# EAGLE design what-tinys-it (EAGLE 6.1)
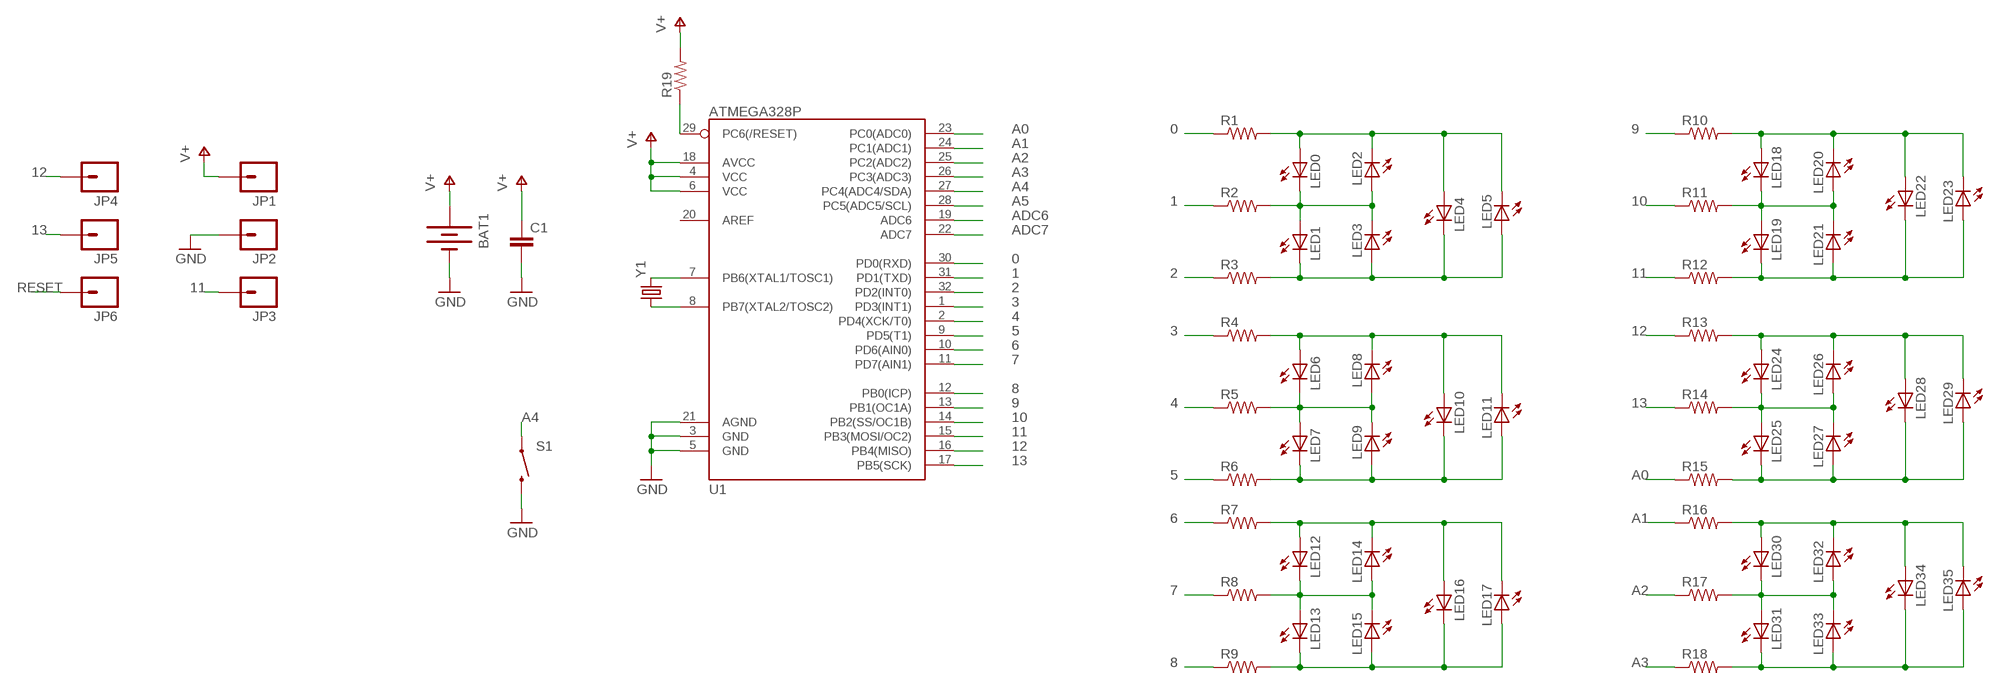
[diagram p0: schematic, sheet 1]

## Parts
BAT1  BATTERY20SMD  [BATTCON_20MM]
C1  C-EUC0805  [C0805]
JP1  M01SMDNS  [1X01NS]
JP2  M01SMDNS  [1X01NS]
JP3  M01SMDNS  [1X01NS]
JP4  M01SMDNS  [1X01NS]
JP5  M01SMDNS  [1X01NS]
JP6  M01SMDNS  [1X01NS]
LED0  LEDCHIPLED_0805  [CHIPLED_0805]
LED1  LEDCHIPLED_0805  [CHIPLED_0805]
LED2  LEDCHIPLED_0805  [CHIPLED_0805]
LED3  LEDCHIPLED_0805  [CHIPLED_0805]
LED4  LEDCHIPLED_0805  [CHIPLED_0805]
LED5  LEDCHIPLED_0805  [CHIPLED_0805]
LED6  LEDCHIPLED_0805  [CHIPLED_0805]
LED7  LEDCHIPLED_0805  [CHIPLED_0805]
LED8  LEDCHIPLED_0805  [CHIPLED_0805]
LED9  LEDCHIPLED_0805  [CHIPLED_0805]
LED10  LEDCHIPLED_0805  [CHIPLED_0805]
LED11  LEDCHIPLED_0805  [CHIPLED_0805]
LED12  LEDCHIPLED_0805  [CHIPLED_0805]
LED13  LEDCHIPLED_0805  [CHIPLED_0805]
LED14  LEDCHIPLED_0805  [CHIPLED_0805]
LED15  LEDCHIPLED_0805  [CHIPLED_0805]
LED16  LEDCHIPLED_0805  [CHIPLED_0805]
LED17  LEDCHIPLED_0805  [CHIPLED_0805]
LED18  LEDCHIPLED_0805  [CHIPLED_0805]
LED19  LEDCHIPLED_0805  [CHIPLED_0805]
LED20  LEDCHIPLED_0805  [CHIPLED_0805]
LED21  LEDCHIPLED_0805  [CHIPLED_0805]
LED22  LEDCHIPLED_0805  [CHIPLED_0805]
LED23  LEDCHIPLED_0805  [CHIPLED_0805]
LED24  LEDCHIPLED_0805  [CHIPLED_0805]
LED25  LEDCHIPLED_0805  [CHIPLED_0805]
LED26  LEDCHIPLED_0805  [CHIPLED_0805]
LED27  LEDCHIPLED_0805  [CHIPLED_0805]
LED28  LEDCHIPLED_0805  [CHIPLED_0805]
LED29  LEDCHIPLED_0805  [CHIPLED_0805]
LED30  LEDCHIPLED_0805  [CHIPLED_0805]
LED31  LEDCHIPLED_0805  [CHIPLED_0805]
LED32  LEDCHIPLED_0805  [CHIPLED_0805]
LED33  LEDCHIPLED_0805  [CHIPLED_0805]
LED34  LEDCHIPLED_0805  [CHIPLED_0805]
LED35  LEDCHIPLED_0805  [CHIPLED_0805]
R1  RESISTOR0805-RES  [0805]
R2  RESISTOR0805-RES  [0805]
R3  RESISTOR0805-RES  [0805]
R4  RESISTOR0805-RES  [0805]
R5  RESISTOR0805-RES  [0805]
R6  RESISTOR0805-RES  [0805]
R7  RESISTOR0805-RES  [0805]
R8  RESISTOR0805-RES  [0805]
R9  RESISTOR0805-RES  [0805]
R10  RESISTOR0805-RES  [0805]
R11  RESISTOR0805-RES  [0805]
R12  RESISTOR0805-RES  [0805]
R13  RESISTOR0805-RES  [0805]
R14  RESISTOR0805-RES  [0805]
R15  RESISTOR0805-RES  [0805]
R16  RESISTOR0805-RES  [0805]
R17  RESISTOR0805-RES  [0805]
R18  RESISTOR0805-RES  [0805]
R19  RESISTOR0805-RES  [0805]
S1  SWITCH-MOMENTARY-2SMD-3  [TACTILE_SWITCH_SMD-3]
U1  ATMEGA328P  ATMEGA328_SMT  [TQFP32-08]
Y1  CRYSTAL32-SMD  [CRYSTAL-32KHZ-SMD]

## Nets
0: R1.1 U1.30(PD0(RXD))
1: R2.1 U1.31(PD1(TXD))
2: R3.1 U1.32(PD2(INT0))
3: R4.1 U1.1(PD3(INT1))
4: R5.1 U1.2(PD4(XCK/T0))
5: R6.1 U1.9(PD5(T1))
6: R7.1 U1.10(PD6(AIN0))
7: R8.1 U1.11(PD7(AIN1))
8: R9.1 U1.12(PB0(ICP))
9: R10.1 U1.13(PB1(OC1A))
10: R11.1 U1.14(PB2(SS/OC1B))
11: JP3.1 R12.1 U1.15(PB3(MOSI/OC2))
12: JP4.1 R13.1 U1.16(PB4(MISO))
13: JP5.1 R14.1 U1.17(PB5(SCK))
A0: R15.1 U1.23(PC0(ADC0))
A1: R16.1 U1.24(PC1(ADC1))
A2: R17.1 U1.25(PC2(ADC2))
A3: R18.1 U1.26(PC3(ADC3))
A4: S1.1 U1.27(PC4(ADC4/SDA))
A5: U1.28(PC5(ADC5/SCL))
ADC6: U1.19(ADC6)
ADC7: U1.22(ADC7)
GND: BAT1.2(-) C1.2 JP2.1 S1.4 U1.3(GND) U1.5(GND) U1.21(AGND)
N$1: LED0.A LED2.C LED4.A LED5.C R1.2
N$2: LED6.A LED8.C LED10.A LED11.C R4.2
N$3: LED0.C LED1.A LED2.A LED3.C R2.2
N$4: LED1.C LED3.A LED4.C LED5.A R3.2
N$5: LED12.A LED14.C LED16.A LED17.C R7.2
N$6: LED6.C LED7.A LED8.A LED9.C R5.2
N$7: LED7.C LED9.A LED10.C LED11.A R6.2
N$8: LED18.A LED20.C LED22.A LED23.C R10.2
N$9: LED12.C LED13.A LED14.A LED15.C R8.2
N$10: LED13.C LED15.A LED16.C LED17.A R9.2
N$11: LED18.C LED19.A LED20.A LED21.C R11.2
N$12: LED24.A LED26.C LED28.A LED29.C R13.2
N$13: LED19.C LED21.A LED22.C LED23.A R12.2
N$14: LED24.C LED25.A LED26.A LED27.C R14.2
N$15: LED30.A LED32.C LED34.A LED35.C R16.2
N$16: U1.7(PB6(XTAL1/TOSC1)) Y1.X2
N$17: LED25.C LED27.A LED28.C LED29.A R15.2
N$18: U1.8(PB7(XTAL2/TOSC2)) Y1.X1
N$19: LED30.C LED31.A LED32.A LED33.C R17.2
N$21: LED31.C LED33.A LED34.C LED35.A R18.2
RESET: JP6.1 R19.1 U1.29(PC6(/RESET))
V+: BAT1.1(+) C1.1 JP1.1 R19.2 U1.4(VCC) U1.6(VCC) U1.18(AVCC)
Unconnected: U1.20(AREF)

## Library data of the parts
BAT1 = SparkFun-Electromechanical:BATTERY: Battery Holders Various common sizes : AA, AAA, 20mm coin cell and 12mm coin cell. 20MM_4LEGS, BATT-10373
C1 = rcl:C-EU: CAPACITOR, European symbol
JP1-JP6 = SparkFun-Connectors:M01: Header 1 Standard 1-pin 0.1" header. Use with straight break away headers (SKU : PRT-00116), right angle break away headers (PRT-00553), swiss pins (PRT-00743), machine pins (PRT-00117), and female headers (PRT-00115).
LED0 LED1-LED35 = adafruit:LED: LED OSRAM: - CHIPLED LG R971, LG N971, LY N971, LG Q971, LY Q971, LO R971, LY R971 LH N974, LH R974 LS Q976, LO Q976, LY Q976 LO Q996 - Hyper CHIPLED LW Q18S LB Q993, LB Q99A, LB R99A - SideLED LS A670, LO A670, LY A670, LG A670, LP A670 LB A673, LV A673, LT A673, LW A673 LH A674 LY A675 LS A676, LA A676, LO A676, LY A676, LW A676 LS A679, LY A679, LG A679 - Hyper Micro SIDELED® LS Y876, LA Y876, LO Y876, LY Y876 LT Y87S - SmartLED LW L88C, LW L88S LB L89C, LB L89S, LG L890 LS L89K, LO L89K, LY L89K LS L896, LA L896, LO L896, LY L896 - TOPLED LS T670, LO T670, LY T670, LG T670, LP T670 LSG T670, LSP T670, LSY T670, LOP T670, LYG T670 LG T671, LOG T671, LSG T671 LB T673, LV T673, LT T673, LW T673 LH T674 LS T676, LA T676, LO T676, LY T676, LB T676, LH T676, LSB T676, LW T676 LB T67C, LV T67C, LT T67C, LS T67K, LO T67K, LY T67K, LW E67C LS E67B, LA E67B, LO E67B, LY E67B, LB E67C, LV E67C, LT E67C LW T67C LS T679, LY T679, LG T679 LS T770, LO T770, LY T770, LG T770, LP T770 LB T773, LV T773, LT T773, LW T773 LH T774 LS E675, LA E675, LY E675, LS T675 LS T776, LA T776, LO T776, LY T776, LB T776 LHGB T686 LT T68C, LB T68C - Hyper Mini TOPLED® LB M676 - Mini TOPLED Santana® LG M470 LS M47K, LO M47K, LY M47K Source: http://www.osram.convergy.de/
R1-R19 = SparkFun-Passives:RESISTOR: Resistor Basic schematic elements and footprints for 0603, 1206, and PTH resistors.
S1 = SparkFun-Electromechanical:SWITCH-MOMENTARY-2: Various NO switches- pushbuttons, reed, etc
U1 = SparkFun-DigitalIC:ATMEGA328_SMT: 32-Pin Atmega328 part Commonly used on Arduino compatible boards Available in QFP and QFN packages TQFP is IC-09069 QFN is non-stock; PROD_ID: IC-09069
Y1 = SparkFun-FreqCtrl:CRYSTAL: Various standard crystals. Proven footprints. Spark Fun Electronics SKU : COM-00534

## Board
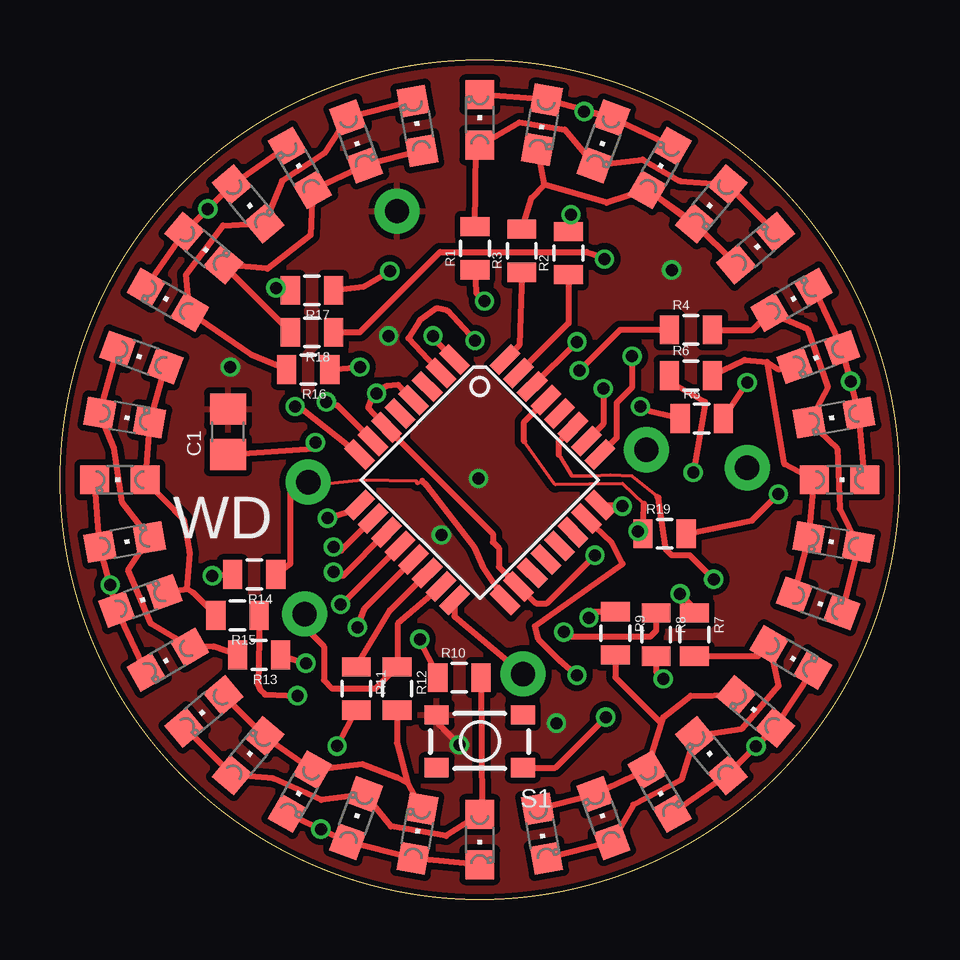
[diagram p1: board, top side]
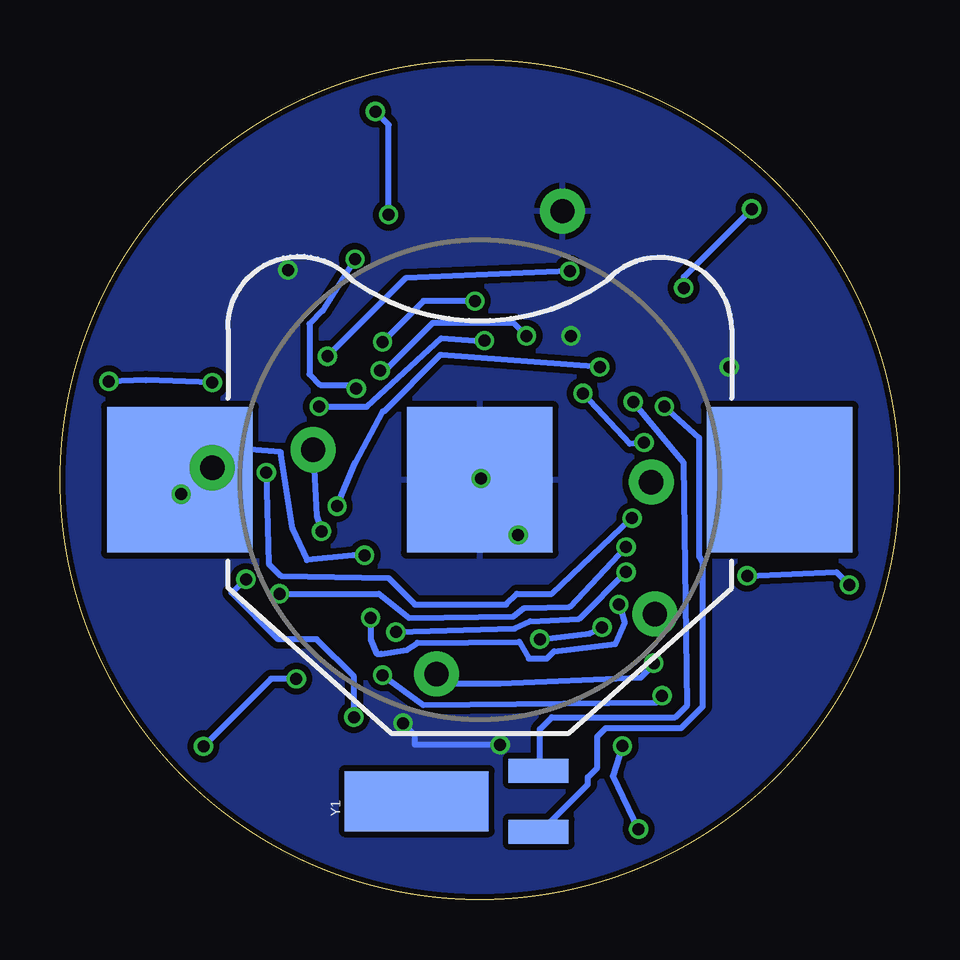
[diagram p2: board, bottom side, seen from below]

Size 35 x 35 mm. Coordinates in mm from the lower left corner, seen from the top.
Outline: circle at 17.5,17.5 radius 17.5
Copper layers (1*16): Top 0.035mm / dielectric 1.5mm / Bottom 0.035mm
Design rules: minimum track width 6mil, minimum drill 12mil, track to track 6mil, track to pad 6mil, pad to pad 6mil, via to via 6mil, smd to smd 0mil, copper to edge 10mil, drill to drill 10mil, minimum pad ring 10mil, minimum via ring 6mil, stop-mask expansion 2mil, vias tented up to drill 100mil, thermal gap 10mil

### Footprints (pad centres in the part's own frame; a part is rotated, then mirrored left to right if it is on the bottom)
BATTCON_20MM = smd 6.07 x 6.07: 1 -12.5,0; 2 0,0; 3 12.5,0
C0805 = smd 1.3 x 1.5: 1 -0.95,0; 2 0.95,0
1X01NS = drill 1.016 pad 1.88: 1 0,0
CHIPLED_0805 = smd 1.2 x 1.2: A 0,-1.05; C 0,1.05
0805 = smd 0.8 x 1.2: 1 -0.9,0; 2 0.9,0
TACTILE_SWITCH_SMD-3 = smd 1 x 0.8: 1 -1.8,1.1; 2 1.8,1.1; 3 -1.8,-1.1; 4 1.8,-1.1
TQFP32-08 = smd 1.27 x 0.559: 1 -4.293,2.8; 2 -4.293,2; 3 -4.293,1.2; 4 -4.293,0.4; 5 -4.293,-0.4; 6 -4.293,-1.2; 7 -4.293,-2; 8 -4.293,-2.8; 17 4.293,-2.8; 18 4.293,-2; 19 4.293,-1.2; 20 4.293,-0.4; 21 4.293,0.4; 22 4.293,1.2; 23 4.293,2; 24 4.293,2.8 | smd 0.559 x 1.27: 9 -2.8,-4.293; 10 -2,-4.293; 11 -1.2,-4.293; 12 -0.4,-4.293; 13 0.4,-4.293; 14 1.2,-4.293; 15 2,-4.293; 16 2.8,-4.293; 25 2.8,4.293; 26 2,4.293; 27 1.2,4.293; 28 0.4,4.293; 29 -0.4,4.293; 30 -1.2,4.293; 31 -2,4.293; 32 -2.8,4.293
CRYSTAL-32KHZ-SMD = smd 2.5 x 6: SHEILD 0,5.08 | smd 1 x 2.5: X1 -1.27,0; X2 1.27,0

### Placement (x,y rotation side)
BAT1  17.5,17.5 0 bottom
C1  7,19.5 90 top
JP1  28.65,18 0 top
JP2  14.05,28.7 0 top
JP3  10.2,11.9 0 top
JP4  19.3,9.4 0 top
JP5  10.35,17.4 0 top
JP6  24.45,18.75 0 bottom
LED0  17.5,32.5 0 top
LED1  20.1,32.3 170 top
LED2  22.65,31.6 160 top
LED3  25,30.5 330 top
LED4  27.15,29 140 top
LED5  29,27.15 310 top
LED6  30.5,25 300 top
LED7  31.61,22.62 110 top
LED8  32.27,20.09 100 top
LED9  32.5,17.5 270 top
LED10  32.25,14.9 80 top
LED11  31.6,12.35 250 top
LED12  30.48,10.09 240 top
LED13  29,7.85 50 top
LED14  27.15,6 40 top
LED15  25,4.5 210 top
LED16  22.65,3.4 20 top
LED17  20.1,2.75 190 top
LED18  17.5,2.5 180 top
LED19  14.9,2.75 350 top
LED20  12.35,3.4 340 top
LED21  10,4.5 150 top
LED22  7.85,6 320 top
LED23  6,7.85 130 top
LED24  4.5,10 120 top
LED25  3.35,12.45 290 top
LED26  2.7,14.9 280 top
LED27  2.5,17.5 90 top
LED28  2.7,20.1 260 top
LED29  3.4,22.6 70 top
LED30  4.5,25 60 top
LED31  6,27.15 230 top
LED32  7.85,29 220 top
LED33  10,30.5 30 top
LED34  12.35,31.6 200 top
LED35  14.9,32.25 10 top
R1  17.3,27.15 90 top
R2  21.2,26.95 90 top
R3  19.25,27.05 90 top
R4  26.3,23.75 0 top
R5  26.75,20.05 0 top
R6  26.3,21.85 0 top
R7  26.45,11.05 270 top
R8  24.85,11.05 270 top
R9  23.15,11.1 270 top
R10  16.65,9.25 0 top
R11  12.35,8.8 270 top
R12  14.05,8.8 270 top
R13  8.3,10.2 180 top
R14  8.1,13.55 180 top
R15  7.4,11.85 180 top
R16  10.35,22.1 180 top
R17  10.5,25.4 180 top
R18  10.5,23.65 180 top
R19  25.2,15.25 0 top
S1  17.5,6.6 180 top
U1  17.5,17.5 315 top
Y1  15.05,4.1 90 bottom

### Tracks (layer width: path | path; a pad name or v marks a point on that pad's centre or on a via)
0  (via drill 0.5)
  Top 0.254: R1.1 17.35,25.3 v17.7,24.95 | v21.55,23.25 U1.30
  Bottom 0.254: v17.7,24.95 19.85,24.95 v21.55,23.25
1
  Top 0.254: R2.1 21.2,24.03 U1.31
2
  Top 0.254: R3.1 19.15,23.11 U1.32
3  (via drill 0.5)
  Top 0.254: R4.1 23.35,23.75 v21.65,22.05 | v15.55,23.5 15.55,23.41 U1.1
  Bottom 0.254: v21.65,22.05 21.45,22.05 19.45,24.05 16.1,24.05 v15.55,23.5
4  (via drill 0.5)
  Top 0.254: R5.1 24.6,20.35 v24.2,20.55 | v17.3,23.3 16.15,24.55 15.7,24.65 15,24.15 14.53,23.4 U1.2
  Bottom 0.254: v24.2,20.55 22.2,20.55 19.1,23.4 17.7,23.3 v17.3,23.3
5  (via drill 0.5)
  Top 0.254: R6.1 25.4,21.6 26.9,20.75 v26.4,17.8 | v11.15,15.9 12.29,16.25 U1.9
  Bottom 0.254: v26.4,17.8 26.3,14 25.8,13.5 21.3,13.4 20.2,12.3 16.4,12.3 15.95,12.75 14.5,12.75 v11.15,15.9
6  (via drill 0.5)
  Top 0.254: R7.1 26.45,12.15 v25.85,12.75 | v11.4,14.7 11.72,14.55 U1.10
  Bottom 0.254: v25.85,12.75 21.7,12.75 20.45,11.75 16.1,11.8 15.65,12.15 13.75,12.2 v11.4,14.7
7  (via drill 0.5)
  Top 0.254: R8.1 24.85,11.2 24.6,10.95 21.05,10.95 v21,11.15 | v11.4,13.65 11.8,13.5 U1.11
  Bottom 0.254: v21,11.15 16.05,11.3 15.4,11.6 13.35,11.7 v11.4,13.65
8  (via drill 0.5)
  Top 0.254: R9.1 22.3,12 v22.05,11.75 | v11.7,12.3 11.63,12.2 U1.12
  Bottom 0.254: v22.05,11.75 22.05,10.85 21.8,10.25 21.6,10.25 20.55,10.4 20.1,10.7 15.85,10.75 15.45,10.05 14.7,10.05 14.4,10.35 11.85,10.65 11.45,11.55 11.6,12.05 v11.7,12.3
9  (via drill 0.5)
  Top 0.254: R10.1 15.75,9.35 15.15,10.5 | 15.1,10.6 15.15,10.5 | 15.15,10.5 v15,10.85 | v12.4,11.35 12.7,12.13 U1.13
  Bottom 0.254: v15,10.85 12.9,11.1 v12.4,11.35
10
  Top 0.254: R11.1 13.75,12.05 U1.14
11
  Top 0.254: U1.15 14.1,11.52 14.1,9.75 R12.1 13.15,8.8 11.35,8.8 11,9.15 11,10.55 9.9,11.65 JP3.1
12  (via drill 0.5)
  Top 0.254: R13.1 10.35,9.8 v10.25,9.85 | U1.16 16.45,11.8 JP4.1
  Bottom 0.254: v10.25,9.85 10.25,9.8 10.8,9.25 16.65,9 19.05,9 JP4.1
13
  Top 0.155: 15.1,17.45 14.9,17.35 14.85,17.45 12.6,17.5 10.85,17.3
  Top 0.254: U1.17 18.55,12.5 17.65,13.85 17.3,14.65 15.25,17.3 15.1,17.45 | JP5.1 10.85,17.3 10.5,17.2 10.3,17.4 9.95,17.4 9.6,17.05 9.6,14 R14.1
A0  (via drill 0.5)
  Top 0.254: R15.1 8.3,10.85 8.25,8.95 8.35,8.75 8.55,8.55 v9.9,8.5 | v21.55,9.35 20.85,9.95 19.95,10.85 19.8,11.4 23.45,14 23,14.88 U1.23
  Bottom 0.254: v9.9,8.5 10.15,8.2 19.85,8.1 v21.55,9.35
A1  (via drill 0.5 pad 0.25)
  Top 0.254: R16.1 v12.5,22.2 | 22.5,16.45 22.65,16.45 | 22.65,16.45 23.4,16.45 v23.45,16.4 | U1.24 22.64,16.45 22.65,16.45
  Bottom 0.254: v12.5,22.2 19.1,22.7 19.15,22.7 21.5,20.35 21.55,20.35 22.7,18.2 v23.45,16.4
A2  (via drill 0.5 pad 0.25)
  Top 0.254: R17.1 12.65,25.55 v13.75,26.2 | v23.85,22.65 23.85,21.35 23.2,20.7 23.2,19.24 U1.25
  Bottom 0.254: v13.75,26.2 20.6,25.9 v23.85,22.65
A3  (via drill 0.5 pad 0.25)
  Top 0.254: R18.1 12.5,23.65 15.85,27 21.95,27 22.75,26.75 | 22.75,26.75 22.8,26.8 | 22.75,26.75 v22.7,26.7 | v22.65,21.3 22.65,19.82 U1.26
  Bottom 0.254: v22.7,26.7 24.05,24.55 24.6,24 24.6,21.9 24.15,21.45 22.8,21.45 v22.65,21.3
A4  (via drill 0.5 pad 0.25)
  Top 0.155: 20.8,18.55 21.35,17.65 22.15,17.65 22.95,17.7 23.85,17.65 24.9,16.8
  Top 0.254: S1.1 20.65,5.5 v22.75,7.6 | v27.25,13.35 26.25,14.35 25.5,14.35 25.25,14.6 24.95,16.75 24.9,16.8 | 20.8,18.55 20.8,19.1 U1.27
  Bottom 0.254: v22.75,7.6 22.75,9.3 24.3,10.85 25.9,10.85 27.85,12.8 27.8,12.8 v27.25,13.35
GND  (via drill 0.5 pad 0.25)
  Top 0.254: S1.4 15.7,7.4 v16.65,6.45
  Bottom 0.254: v16.65,6.45 20.2,6.45 20.2,6.85 v20.7,7.35 | v15.9,15.2 15.9,15.9 BAT1.2
  other vias: 17.45,17.55 7.1,22.2 25.5,26.25 13.7,23.5
  pour Bottom (isolate 0.254): -5.2,37.05 39.25,37.05 39.25,-1.65 -5.3,-1.65 -5.3,37.1
  pour Top (isolate 0.254): -3.3,39.5 41.15,39.5 41.25,-4 -3.35,-3.65 -3.4,39.55
N$1
  Top 0.254: LED5.C LED4.A 25.85,29.95 24.3,30.85 LED2.C 21.05,32.1 19.15,32.4 LED0.A 17.35,31.3 R1.2
N$2
  Top 0.254: LED11.C LED10.A 32.5,16.3 32.4,18.8 LED8.C 32,21.35 31.15,23.8 LED6.A 28.87,23.75 R4.2
N$3  (via drill 0.5)
  Top 0.254: LED3.C LED2.A 22.38,32.76 | LED0.C LED1.A 22.38,32.76 | R2.2 21.2,28.45 v21.3,28.55 | v21.85,32.85 22.38,32.76
  Bottom 0.254: v21.3,28.55 21.3,32.3 v21.85,32.85
N$4
  Top 0.254: LED5.A 26.45,28.2 26.35,28.2 24.88,29.31 | 24.88,29.31 24.5,29.6 24.48,29.6 LED3.A 22.8,29.05 20.2,29.8 | LED4.C 24.88,29.31 | 20.2,29.8 LED1.C | R3.2 19.65,29.25 20.2,29.8
N$5
  Top 0.254: LED17.C LED16.A 23.9,3.95 25.9,5 LED14.C 28.4,7.1 29.95,8.9 LED12.A 29.1,10.15 R7.2
N$6  (via drill 0.5)
  Top 0.254: LED9.C LED8.A v32.96,21.6 LED7.A LED6.C | R5.2 v28.65,21.55
  Bottom 0.254: v28.65,21.55 31.41,21.65 v32.96,21.6
N$7
  Top 0.254: LED11.A LED10.C LED9.A 30.2,18.15 29.49,22.41 | 29.49,22.41 29.95,22.1 LED7.C | R6.2 28.55,22.5 29.49,22.41
N$8
  Top 0.254: LED23.C LED22.A 8.9,5.05 10.9,4.15 LED20.C 13.8,3.05 16.1,2.65 LED18.A 17.6,3.65 R10.2
N$9  (via drill 0.5)
  Top 0.254: LED12.C LED13.A v29.02,6.38 LED14.A LED15.C | R8.2 24.85,9.5 v25.15,9.2
  Bottom 0.254: v25.15,9.2 26.2,9.2 v29.02,6.38
N$10
  Top 0.254: LED17.A LED16.C LED15.A 25.07,7.35 | 25.07,7.35 25.15,7.6 26.3,8.5 LED13.C | R9.2 23.15,9.27 25.07,7.35
N$11  (via drill 0.5)
  Top 0.254: LED18.C LED19.A LED20.A v10.88,2.93 LED21.C | R11.2 v11.55,6.4
  Bottom 0.254: v11.55,6.4 11.95,5.15 v10.88,2.93
N$12
  Top 0.254: LED29.C LED28.A 2.25,18.8 2.6,16.55 LED26.C 2.85,13.75 3.8,11.5 LED24.A 6.38,10.55 R13.2
N$13
  Top 0.254: LED23.A LED22.C LED21.A 12.6,5.65 14.05,5.1 14.49,4.87 | 14.49,4.87 LED19.C | R12.2 14.05,6.53 14.49,4.87
N$14  (via drill 0.5)
  Top 0.254: LED27.C LED26.A v2.09,13.12 LED25.A LED24.C | R14.2 v6.35,13.5
  Bottom 0.254: v6.35,13.5 2.63,13.65 v2.09,13.12
N$15
  Top 0.254: LED35.C LED34.A 11,31.1 9.25,29.95 LED32.C 6.8,28.1 5.25,26.05 LED30.A 7.98,22.7 R16.2
N$16  (via drill 0.5 pad 0.25)
  Top 0.254: v11.1,20.75 11.57,20.6 U1.7
  Bottom 0.254: 15,5.3 15,5.5 15,7.1 14.5,7.6 9.35,7.6 8.85,8.1 9,18.2 v11.1,20.75
  Bottom 0.406: Y1.X2 15,5.37 15,5.5
N$17
  Top 0.254: LED29.A LED28.C LED27.A 5.15,15.85 5.4,14.45 5.29,12.96 | R15.2 5.55,12.8 5.29,12.96 | LED25.C 5.29,12.96
N$18  (via drill 0.5 pad 0.25)
  Top 0.254: v9.8,20.55 10.09,20.45 U1.8
  Bottom 0.254: 15,2.76 15,2.8 14.88,2.93 13,4.8 13,5.1 12.6,5.5 12.6,6.8 12.25,7.15 9.1,7.15 8.2,8.05 8.2,14 8.35,14.3 8.35,19.25 v9.8,20.55
  Bottom 0.406: Y1.X1 14.88,2.83 14.88,2.93
N$19  (via drill 0.5 pad 0.25)
  Top 0.254: LED30.C LED31.A v6.16,28.79 LED32.A LED33.C | R17.2 9.1,25.4 v9,25.5
  Bottom 0.254: v9,25.5 9,25.95 v6.16,28.79
N$21
  Top 0.254: LED35.A LED34.C LED33.A 10.45,27.7 8.65,26.3 LED31.C 9.6,23.68 R18.2
RESET  (via drill 0.5 pad 0.25)
  Top 0.155: 19.35,19.1 20.6,17.35 20.65,17.3 23.45,17.35 24.35,16.5
  Top 0.254: 19.35,19.1 19.35,19.92 U1.29 | 24.35,16.5 R19.1 24.2,15.35 v24.1,15.35
  Bottom 0.254: JP6.1 24.3,16 v24.1,15.35
V+  (via drill 0.5 pad 0.25)
  Top 0.254: U1.4 14.68,20.82 14.1,21.45 13.6,21.4 v13.2,21.1 12.95,20.8 12.85,20.5 U1.6 18.05,15.25 18.05,14.9 18.3,14.65 18.3,13.87 U1.18 19.15,13.05 19.85,12.35 20.3,12.35 v22.3,14.35 | R19.2 28.85,15.8 v29.95,16.9 | C1.1 10.6,18.8 10.75,18.95 v10.65,19.05
  Bottom 0.254: v29.95,16.9 30,16.9 30,17.4 | 30,17.4 29.4,18 JP1.1 28.15,18.85 25.8,18.65 25.3,15.45 24.7,14.15 22.8,14.35 v22.3,14.35 | 30,17.4 BAT1.1 | v10.65,19.05 11.25,19 v13.2,21.1

### Text on the board
tPlace: WD